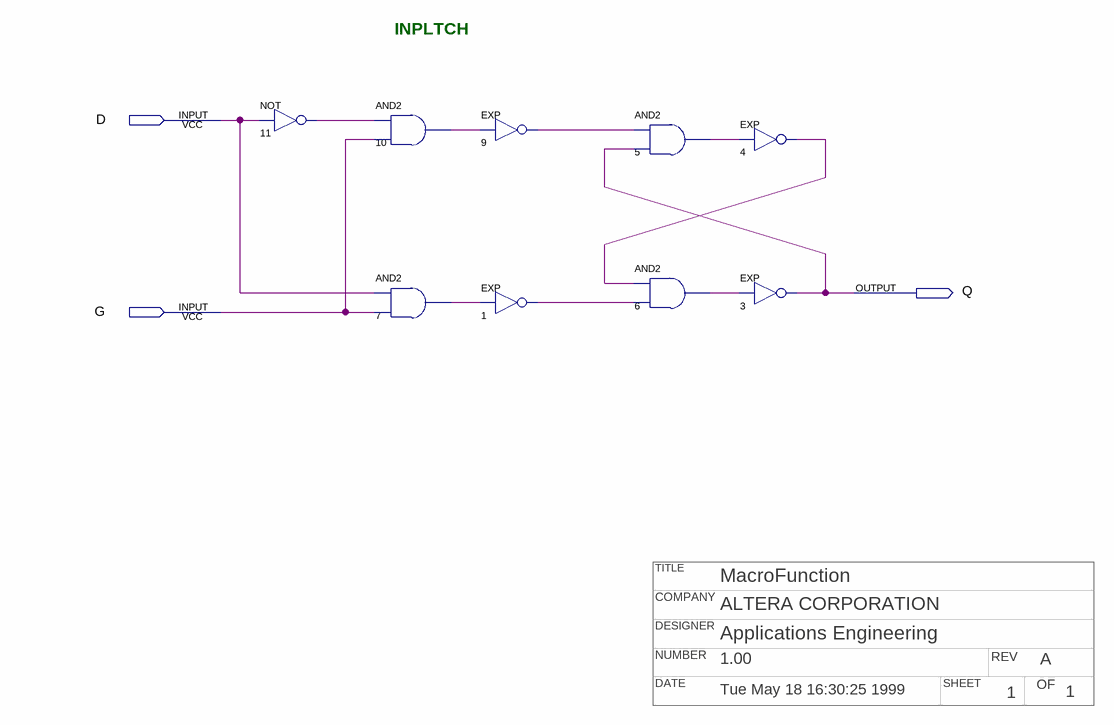
[diagram p0: schematic sheet]
// Quartus schematic inpltch.bdf as structural Verilog: 9 symbols, 3 pins
// Title block: TITLE: MacroFunction; COMPANY: ALTERA CORPORATION; DESIGNER: Applications Engineering; NUMBER: 1.00; REV: A; DATE: Tue May 18 16:30:25 1999; SHEET: 1; OF: 1
module inpltch (
  input  D,
  input  G,
  output Q
);

  wire n1_out, n4_out, n5_out, n6_out, n7_out, n9_out, n10_out, n11_out;

  not u_11 (n11_out, D);
  and u_10 (n10_out, n11_out, G);
  and u_7 (n7_out, D, G);
  EXP u_9 (.IN(n10_out), .OUT(n9_out));
  EXP u_1 (.IN(n7_out), .OUT(n1_out));
  and u_5 (n5_out, n9_out, Q);
  and u_6 (n6_out, n4_out, n1_out);
  EXP u_4 (.IN(n5_out), .OUT(n4_out));
  EXP u_3 (.IN(n6_out), .OUT(Q));

  // Notes on the sheet:
  //   INPLTCH
endmodule
